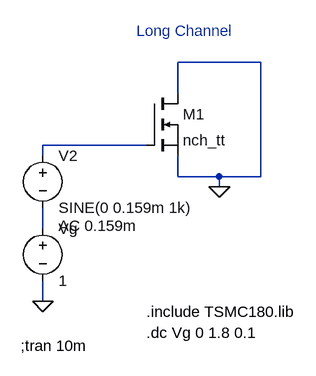
[diagram p0: schematic Prob_2a.asc]
Prob_2a.asc, the LTspice schematic file:
Version 4
SHEET 1 956 680
WIRE 432 -96 304 -96
WIRE 304 -48 304 -96
WIRE 256 32 96 32
WIRE 96 48 96 32
WIRE 304 80 304 48
WIRE 368 80 304 80
WIRE 432 80 432 -96
WIRE 432 80 368 80
WIRE 368 96 368 80
WIRE 96 160 96 128
WIRE 96 272 96 240
FLAG 96 272 0
FLAG 368 96 0
SYMBOL voltage 96 32 R0
WINDOW 123 24 124 Left 2
WINDOW 39 0 0 Left 0
SYMATTR InstName V2
SYMATTR Value SINE(0 0.159m 1k)
SYMATTR Value2 AC 0.159m
SYMBOL nmos 256 -48 R0
SYMATTR InstName M1
SYMATTR Value nch_tt
SYMATTR Value2 W=6u L = 10u
SYMBOL voltage 96 144 R0
WINDOW 123 0 0 Left 0
WINDOW 39 0 0 Left 0
SYMATTR InstName Vg
SYMATTR Value 1
TEXT 240 -144 Left 2 ;Long Channel
TEXT 256 288 Left 2 !.include TSMC180.lib
TEXT 256 320 Left 2 !.dc Vg 0 1.8 0.1
TEXT 62 340 Left 2 !;tran 10m

The netlist it stands for:
* Prob_2a.asc
V2 N001 N002 SINE(0 0.159m 1k) AC 0.159m
M1 0 N001 0 0 nch_tt W=6u L = 10u
Vg N002 0 1
.model NMOS NMOS
.model PMOS PMOS
.lib standard.mos
* Long Channel
.include TSMC180.lib
.dc Vg 0 1.8 0.1
;tran 10m
.backanno
.end